# EAGLE design long (EAGLE 7.0.0)
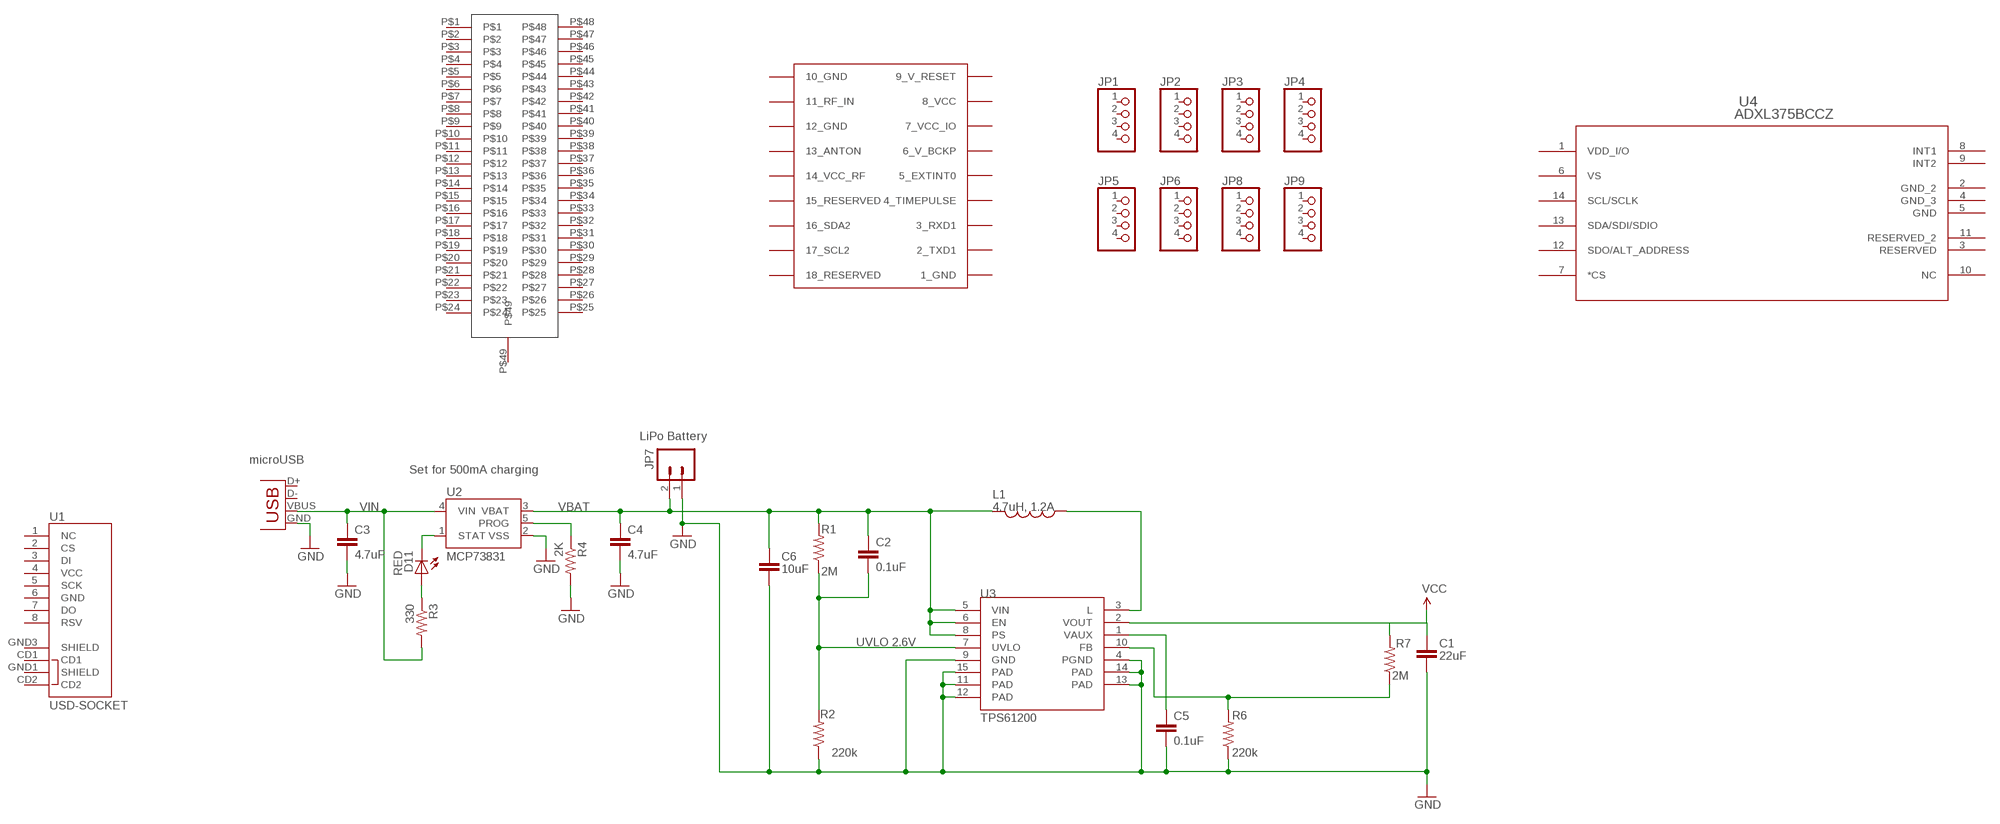
[diagram p0: schematic, sheet 1]

## Parts
C1  22uF  CAP0805  [0805]
C2  0.1uF  CAP0603-CAP  [0603-CAP]
C3  4.7uF  CAP0402-CAP  [0402-CAP]
C4  4.7uF  CAP0402-CAP  [0402-CAP]
C5  0.1uF  CAP0603-CAP  [0603-CAP]
C6  10uF  CAP1206  [1206]
D11  RED  LED0603  [LED-0603]
JP1  PINHD-1X4  [1X04]
JP2  PINHD-1X4  [1X04]
JP3  PINHD-1X4  [1X04]
JP4  PINHD-1X4  [1X04]
JP5  PINHD-1X4  [1X04]
JP6  PINHD-1X4  [1X04]
JP7  LiPo Battery  M02-JST-2MM-SMT  [JST-2-SMD]
JP8  PINHD-1X4  [1X04]
JP9  PINHD-1X4  [1X04]
L1  4.7uH, 1.2A  INDUCTOR.  [CDRH2D09]
R1  2M  RESISTOR0603-RES  [0603-RES]
R2  220k  RESISTOR0603-RES  [0603-RES]
R3  330  RESISTOR0402-RES  [0402-RES]
R4  2K  RESISTOR0402-RES  [0402-RES]
R6  220k  RESISTOR0603-RES  [0603-RES]
R7  2M  RESISTOR0603-RES  [0603-RES]
U1  USD-SOCKET  [MICROSD_1:1]
U2  MCP73831  [SOT23-5]
U3  TPS61200  [QFN-10_PAD]
U4  ADXL375BCCZ  [LGA_CC-14-1]
U$1  STM32F411CEU6  [STM32F411CEU6]
U$2  UBLOX_MAX  [UBLOX_MAX]
X1  Micro USB  USB-MICROB  [USB-MICROB]

## Nets
FB: R6.2 R7.1 U3.10(FB)
GND: C1.2 C3.2 C4.2 C5.2 C6.2 JP7.1 R2.1 R4.2 R6.1 U2.2(VSS) U3.4(PGND) U3.9(GND) U3.11(PAD) U3.12(PAD) U3.13(PAD) U3.14(PAD) U3.15(PAD) X1.GND
N$1: C5.1 U3.1(VAUX)
N$2: L1.P$1 U3.3(L)
N$3: D11.A R3.1
PROG: R4.1 U2.5(PROG)
STAT: D11.C U2.1(STAT)
UVLO: C2.2 R1.1 R2.2 U3.7(UVLO)
VBAT: C2.1 C4.1 C6.1 JP7.2 L1.P$2 R1.2 U2.3(VBAT) U3.5(VIN) U3.6(EN) U3.8(PS)
VCC: C1.1 R7.2 U3.2(VOUT)
VIN: C3.1 R3.2 U2.4(VIN) X1.VBUS
Unconnected: JP1.1 JP1.2 JP1.3 JP1.4 JP2.1 JP2.2 JP2.3 JP2.4 JP3.1 JP3.2 JP3.3 JP3.4 JP4.1 JP4.2 JP4.3 JP4.4 JP5.1 JP5.2 JP5.3 JP5.4 JP6.1 JP6.2 JP6.3 JP6.4 JP8.1 JP8.2 JP8.3 JP8.4 JP9.1 JP9.2 JP9.3 JP9.4 U1.1(NC) U1.2(CS) U1.3(DI) U1.4(VCC) U1.5(SCK) U1.6(GND) U1.7(DO) U1.8(RSV) U1.CD1 U1.CD2 U1.GND1(SHIELD) U1.GND3(SHIELD) U4.1(VDD_I/O) U4.2(GND_2) U4.3(RESERVED) U4.4(GND_3) U4.5(GND) U4.6(VS) U4.7(*CS) U4.8(INT1) U4.9(INT2) U4.10(NC) U4.11(RESERVED_2) U4.12(SDO/ALT_ADDRESS) U4.13(SDA/SDI/SDIO) U4.14(SCL/SCLK) U$1.P$1 U$1.P$2 U$1.P$3 U$1.P$4 U$1.P$5 U$1.P$6 U$1.P$7 U$1.P$8 U$1.P$9 U$1.P$10 U$1.P$11 U$1.P$12 U$1.P$13 U$1.P$14 U$1.P$15 U$1.P$16 U$1.P$17 U$1.P$18 U$1.P$19 U$1.P$20 U$1.P$21 U$1.P$22 U$1.P$23 U$1.P$24 U$1.P$25 U$1.P$26 U$1.P$27 U$1.P$28 U$1.P$29 U$1.P$30 U$1.P$31 U$1.P$32 U$1.P$33 U$1.P$34 U$1.P$35 U$1.P$36 U$1.P$37 U$1.P$38 U$1.P$39 U$1.P$40 U$1.P$41 U$1.P$42 U$1.P$43 U$1.P$44 U$1.P$45 U$1.P$46 U$1.P$47 U$1.P$48 U$1.P$49 U$2.2_TXD1 U$2.3_RXD1 U$2.4_TIMEPULSE U$2.5_EXTINT0 U$2.6_V_BCKP U$2.11_RF_IN U$2.13_ANTON U$2.14_VCC_RF U$2.15_RESERVED U$2.16_SDA2 U$2.17_SCL2 U$2.18_RESERVED X1.D+ X1.D-

## Notes on the sheet
- microUSB
- Set for 500mA charging
- UVLO 2.6V

## Power pins joined to a net without a drawn wire
1_GND: U$2.1_GND
7_VCC_IO: U$2.7_VCC_IO
8_VCC: U$2.8_VCC
9_V_RESET: U$2.9_V_RESET
10_GND: U$2.10_GND
12_GND: U$2.12_GND

## Library data of the parts
C1 C6 = CH_passive:CAP: Capacitor Standard 0603 ceramic capacitor, and 0.1" leaded capacitor.
C2-C5 = SparkFun:CAP: Capacitor Standard 0603 ceramic capacitor, and 0.1" leaded capacitor.
D11 = SparkFun:LED: LEDs Standard schematic elements and footprints for 5mm, 3mm, 1206, and 0603 sized LEDs. 5mm - Spark Fun Electronics SKU : COM-00529 (and others)
JP1-JP6 JP8 JP9 = pinhead:PINHD-1X4: PIN HEADER
JP7 = SparkFun:M02: Header 2 Standard 2-pin 0.1" header. Use with straight break away headers (SKU : PRT-00116), right angle break away headers (PRT-00553), swiss pins (PRT-00743), machine pins (PRT-00117), and female headers (PRT-00115). Molex polarized connector foot print use with SKU : PRT-08233 with associated crimp pins and housings.
L1 = SparkFun:INDUCTOR: Inductors Basic Inductor/Choke - 0603 and 1206. Footprints are not proven and vary greatly between part numbers.
R1-R4 R6 R7 = SparkFun:RESISTOR: Resistor Basic schematic elements and footprints for 0603, 1206, and PTH resistors.
U1 = SparkFun-Connectors:USD-SOCKET: microSD Socket Push-push type uSD socket. Schematic element and footprint production proven. Spark Fun Electronics SKU : PRT-00127. tDoc lines correctly indicate media card edge positions when inserting (unlocked, locked, depressed). NOTE: CD1 and CD2 are connected internally; PROD_ID: CONN-07820
U2 = SparkFun:MCP73831: Microchip's MCP73831 Miniature single cell, fully integrated Li-Ion, Li-polymer charge management controller http://ww1.microchip.com/downloads/en/DeviceDoc/21984a.pdf
U3 = SparkFun:TPS61200: DC to DC Booster
U4 = adxl375bccz:ADXL375BCCZ
U$1 = STM32F411CEU6:STM32F411CEU6
U$2 = Ava:UBLOX_MAX: UBLOX MAX
X1 = SparkFun:USB: USB Connectors USB-B-PTH is fully proven SKU : PRT-00139 USB-miniB is fully proven SKU : PRT-00587 USB-A-PCB is untested. USB-A-H is throughly reviewed, but untested. Spark Fun Electronics SKU : PRT-00437 USB-B-SMT is throughly reviewed, but untested. Needs silkscreen touching up. USB-A-S has not been used/tested USB-MB-H has not been used/tested

## Board
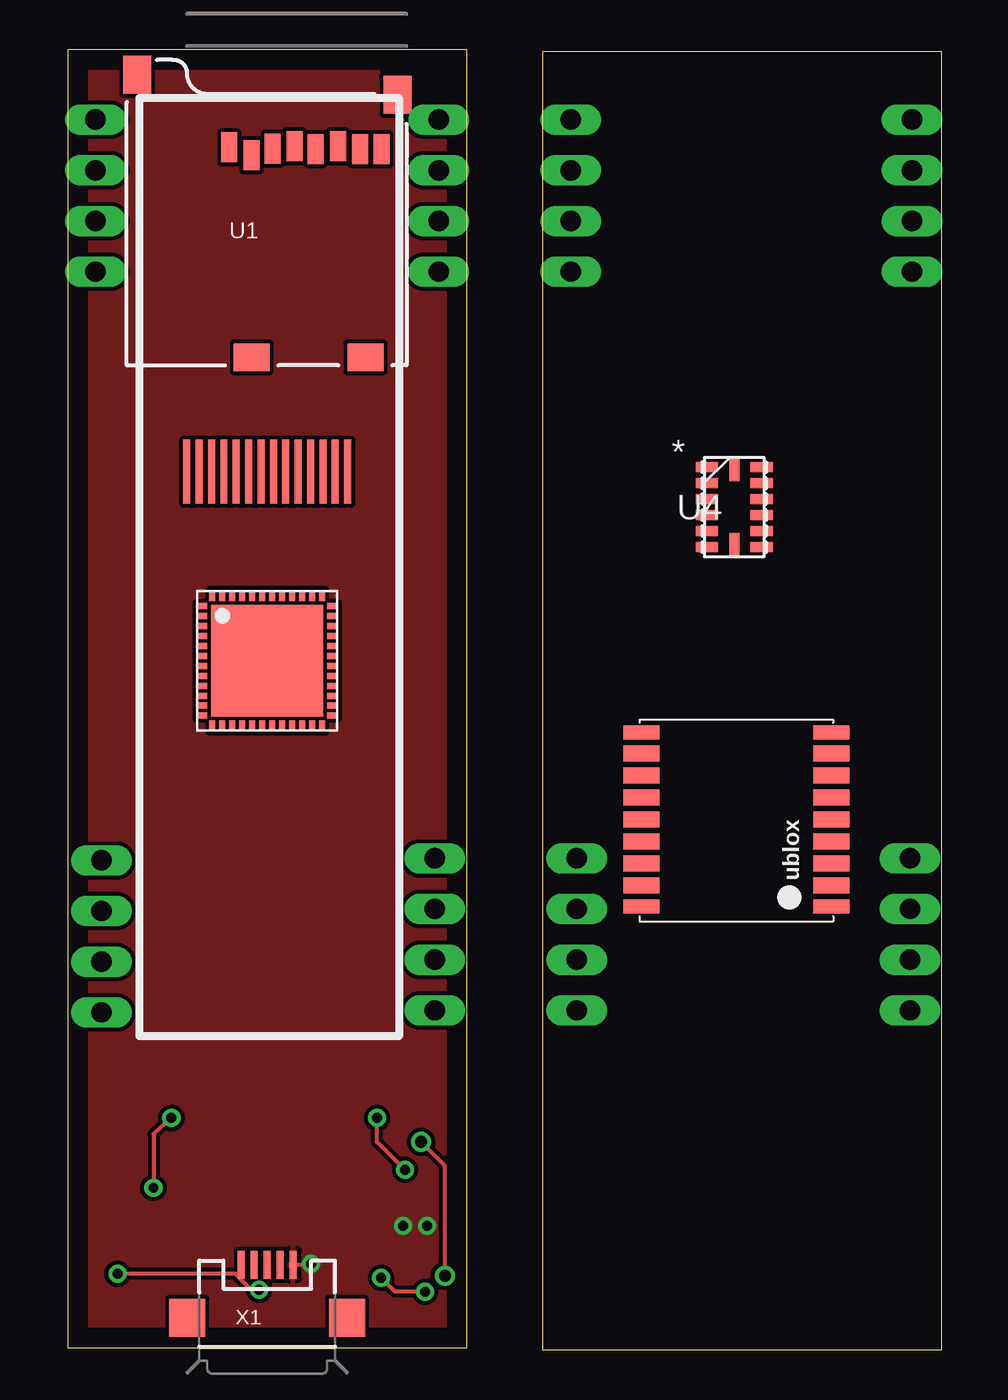
[diagram p1: board, top side]
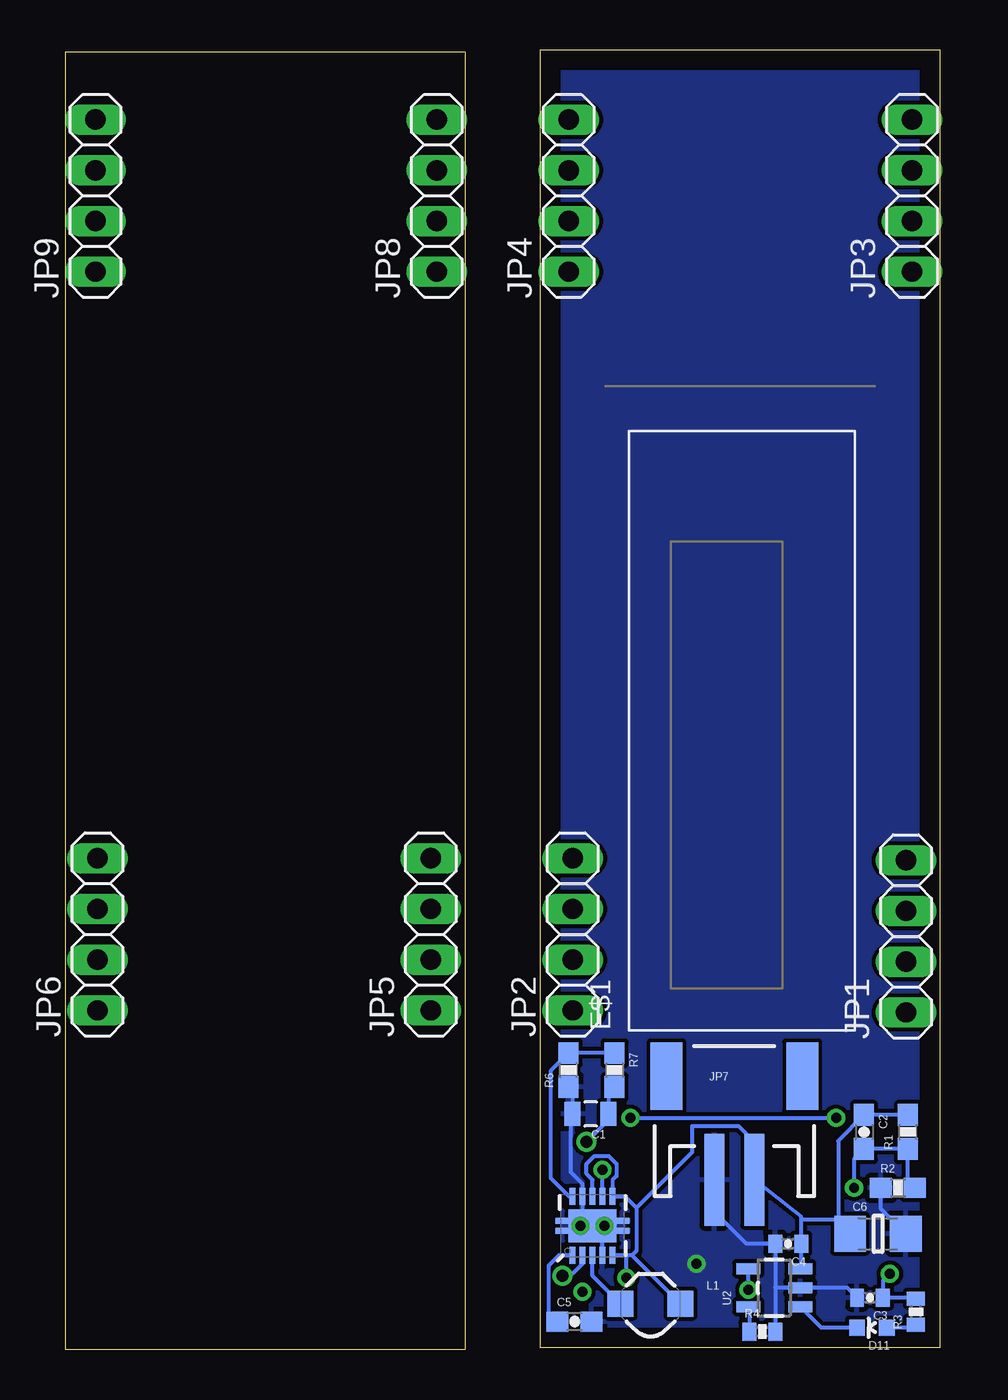
[diagram p2: board, bottom side, seen from below]

Size 43.8 x 65.1 mm. Coordinates in mm from the lower left corner, seen from the top.
Outline: 0,0.1 20,0.1 20,65.1 0,65.1 0,0.1
Outline: 23.8,0 43.8,0 43.8,65 23.8,65 23.8,0
Copper layers (1*16): Top 0.035mm / dielectric 1.5mm / Bottom 0.035mm
Design rules "default": minimum track width 10mil, minimum drill 24mil, track to track 8mil, track to pad 8mil, pad to pad 8mil, via to via 8mil, smd to smd 8mil, copper to edge 40mil, drill to drill 8mil, minimum pad ring 10mil, minimum via ring 8mil, stop-mask expansion 4mil, vias tented up to drill 0mil, thermal gap 10mil

### Footprints (pad centres in the part's own frame; a part is rotated, then mirrored left to right if it is on the bottom)
0805 = smd 0.8 x 1.2: 1 -0.9,0; 2 0.9,0
0603-CAP = smd 1.1 x 1: 1 -0.85,0; 2 0.85,0
0402-CAP = smd 0.7 x 0.9: 1 -0.65,0; 2 0.65,0
1206 = smd 1.6 x 1.8: 1 -1.4,0; 2 1.4,0
LED-0603 = smd 0.8 x 0.8: A 0,-0.75; C 0,0.75
UG-2832HSWEG02_WRAPUNDER = smd 3.2 x 0.35 bottom: 1 -2.03,-4.03; 2 -2.03,-3.41; 3 -2.03,-2.79; 4 -2.03,-2.17; 5 -2.03,-1.55; 6 -2.03,-0.93; 7 -2.03,-0.31; 8 -2.03,0.31; 9 -2.03,0.93; 10 -2.03,1.55; 11 -2.03,2.17; 12 -2.03,2.79; 13 -2.03,3.41; 14 -2.03,4.03
1X04 = drill 1.016 long: 1 -3.81,0; 2 -1.27,0; 3 1.27,0; 4 3.81,0
JST-2-SMD = smd 1 x 4.6: 1 -1,-3.7; 2 1,-3.7 | smd 1.6 x 3.4: NC1 -3.4,1.5; NC2 3.4,1.5
CDRH2D09 = smd 1.3 x 1.3: P$1 -1.5,0; P$2 1.5,0
0603-RES = smd 1.1 x 1: 1 -0.85,0; 2 0.85,0
0402-RES = smd 0.7 x 0.9: 1 -0.65,0; 2 0.65,0
MICROSD_1:1 = smd 0.8 x 1.5: 1 5.096,10.919; 2 6.218,10.519; 3 7.274,10.853; 4 8.367,10.982; 5 9.421,10.828; 6 10.539,10.973; 7 11.648,10.819; 8 12.721,10.819 | smd 1.8 x 1.4: CD1 11.92,0.4; CD2 6.22,0.4 | smd 1.4 x 1.9: GND1 0.497,14.55; GND3 13.52,13.55
SOT23-5 = smd 0.55 x 1.2: 1 -0.95,-1.3; 2 0,-1.3; 3 0.95,-1.3; 4 0.95,1.3; 5 -0.95,1.3
QFN-10_PAD = smd 0.297 x 0.85: 1 -1,-1.475; 2 -0.5,-1.475; 3 0,-1.475; 4 0.5,-1.475; 5 1,-1.475; 6 1,1.475; 7 0.5,1.475; 8 0,1.475; 9 -0.5,1.475; 10 -1,1.475 | smd 0.7 x 0.28: 11 -1.5,0.25; 12 -1.5,-0.25; 13 1.5,0.25; 14 1.5,-0.25 | smd 2.4 x 1.65: 15 0,0
LGA_CC-14-1 = smd 1.118 x 0.508: 1 -1.371,2; 2 -1.371,1.2; 3 -1.371,0.4; 4 -1.371,-0.4; 5 -1.371,-1.2; 6 -1.371,-2; 8 1.371,-2; 9 1.371,-1.2; 10 1.371,-0.4; 11 1.371,0.4; 12 1.371,1.2; 13 1.371,2 | smd 0.508 x 1.118: 7 0,-1.871; 14 0,1.871
STM32F411CEU6 = smd 0.55 x 0.3: P$1 0.225,6.25; P$2 0.225,5.75; P$3 0.225,5.25; P$4 0.225,4.75; P$5 0.225,4.25; P$6 0.225,3.75; P$7 0.225,3.25; P$8 0.225,2.75; P$9 0.225,2.25; P$10 0.225,1.75; P$11 0.225,1.25; P$12 0.225,0.75; P$25 6.775,0.75; P$26 6.775,1.25; P$27 6.775,1.75; P$28 6.775,2.25; P$29 6.775,2.75; P$30 6.775,3.25; P$31 6.775,3.75; P$32 6.775,4.25; P$33 6.775,4.75; P$34 6.775,5.25; P$35 6.775,5.75; P$36 6.775,6.25 | smd 0.3 x 0.55: P$13 0.75,0.225; P$14 1.25,0.225; P$15 1.75,0.225; P$16 2.25,0.225; P$17 2.75,0.225; P$18 3.25,0.225; P$19 3.75,0.225; P$20 4.25,0.225; P$21 4.75,0.225; P$22 5.25,0.225; P$23 5.75,0.225; P$24 6.25,0.225; P$37 6.25,6.775; P$38 5.75,6.775; P$39 5.25,6.775; P$40 4.75,6.775; P$41 4.25,6.775; P$42 3.75,6.775; P$43 3.25,6.775; P$44 2.75,6.775; P$45 2.25,6.775; P$46 1.75,6.775; P$47 1.25,6.775; P$48 0.75,6.775 | smd 5.6 x 5.6: P$49 3.5,3.5
UBLOX_MAX = smd 1.8 x 0.7: 1_GND 4.95,-4.4; 9_V_RESET 4.95,4.3; 10_GND -4.55,4.3; 18_RESERVED -4.55,-4.4 | smd 1.8 x 0.8: 2_TXD1 4.95,-3.35; 3_RXD1 4.95,-2.25; 4_TIMEPULSE 4.95,-1.15; 5_EXTINT0 4.95,-0.05; 6_V_BCKP 4.95,1.05; 7_VCC_IO 4.95,2.15; 8_VCC 4.95,3.25; 11_RF_IN -4.55,3.25; 12_GND -4.55,2.15; 13_ANTON -4.55,1.05; 14_VCC_RF -4.55,-0.05; 15_RESERVED -4.55,-1.15; 16_SDA2 -4.55,-2.25; 17_SCL2 -4.55,-3.35
USB-MICROB = smd 0.35 x 1.4: D+ 0,2.65; D- -0.65,2.65; GND 1.3,2.65; ID 0.65,2.65; VBUS -1.3,2.65 | smd 1.8 x 1.9: MT1 -4,0; MT2 4,0

### Placement (x,y rotation side)
C1  17.5,11.8 180 bottom
C2  3.8,10.9 270 bottom
C3  3.5,2.6 180 bottom
C4  7.6,5.3 180 bottom
C5  18.3,1.4 0 bottom
C6  3.1,5.8 0 bottom
D11  3.4,1.1 90 bottom
E$1  [UG-2832HSWEG02_WRAPUNDER]  10,46 90 bottom
JP1  1.7,20.7 90 bottom
JP2  18.4,20.8 90 bottom
JP3  1.4,57.8 90 bottom
JP4  18.6,57.8 90 bottom
JP5  25.5,20.8 90 bottom
JP6  42.2,20.8 90 bottom
JP7  10.3,12.2 0 bottom
JP8  25.2,57.8 90 bottom
JP9  42.3,57.8 90 bottom
L1  14.5,2.3 0 bottom
R1  1.6,10.9 90 bottom
R2  2.1,8.1 0 bottom
R3  1.2,1.9 90 bottom
R4  8.9,0.9 0 bottom
R6  18.6,14 90 bottom
R7  16.3,14 270 bottom
U1  3,49.3 0 top
U2  8.3,3.1 90 bottom
U3  17.4,6.2 0 bottom
U4  33.4,42.2 0 top
U$1  6.5,31 0 top
U$2  33.3,26.6 0 top
X1  10,1.6 0 top

### Tracks (layer width: path | path; a pad name or v marks a point on that pad's centre or on a via)
FB
  Bottom 0.2: R7.1 R6.2 19.5,13.95 19.5,8.6 18.57,7.67 U3.10
GND  (via drill 0.5 pad 0.41)
  Top 0.2: X1.GND v12.2,4.3
  Bottom 0.2: C3.2 4.65,3.1 U2.2 8.25,3.1 | 8.25,3.1 R4.2 | 8.25,3.1 C4.2 9.7,5.3 11.3,6.9 JP7.1 | C6.2 2.95,7.05 R2.1 | R6.1 18.4,13.05 C1.2 18.5,11.2 18.5,8.9 17.9,8.3 U3.9 17.9,6.6 17.5,6.2 U3.15 | U3.4 16.9,5.7 U3.15 | U3.13 U3.15 | U3.14 U3.15 | U3.11 v16.8,6.2 U3.12
  other vias: 18,6.2
  pour Bottom: 20.1,65.2 20.1,0 -0.1,0 -0.1,65.2
  pour Top: 20.3,65.4 20.3,-0.2 -0.3,-0.2 -0.3,65.4
N$1
  Bottom 0.2: U3.1 19.07,4.72 19.6,4.2 19.6,1.85 C5.1
N$2
  Bottom 0.2: L1.P$1 17.4,3.7 U3.3
N$3
  Bottom 0.2: R3.1 1.35,1.1 D11.A
  Bottom 0.406: 2.65,1.25 D11.A
PROG
  Bottom 0.2: U2.5 9.55,2.15 R4.1
  Bottom 0.406: R4.1 9.6,0.9
STAT
  Bottom 0.2: D11.C 5.95,1.1 U2.1
UVLO  (via drill 0.5 pad 0.41)
  Top 0.2: v16.9,9 15.5,10.4 v15.5,11.6 | v5.2,11.6 4.3,10.8 v4.3,8.1
  Bottom 0.2: R2.2 1.6,8.45 R1.1 C2.2 4.3,9.55 v4.3,8.1 | U3.7 v16.9,9 | v15.5,11.6 v5.2,11.6
VBAT  (via drill 0.5 pad 0.41)
  Top 0.2: v17.9,2.9 16.4,2.9 v15.7,3.6
  Bottom 0.2: U2.3 6.95,4.05 C4.1 6.95,6.5 | 6.95,6.5 6.95,6.65 JP7.2 | R1.2 C2.1 5.1,10.45 5.1,6.3 4.6,5.8 C6.1 5.2,6.5 6.95,6.5 | L1.P$2 15.43,4.72 | 15.43,4.72 15.8,4.72 | 15.8,4.72 U3.5 | 15.2,7.1 15.78,7.67 U3.6 16.4,8.5 16.2,8.7 16.2,9.3 16.6,9.7 17.3,9.7 17.7,9.3 17.7,8.8 17.4,8.5 U3.8 | 15.2,7.1 15.2,4.95 15.43,4.72 | v15.7,3.6 15.7,4.62 15.8,4.72 | JP7.2 9.3,8.9 | 15.2,7.1 12.4,9.9 12.4,11.2 10.1,11.2 9.3,10.4 JP7.2
  Bottom 0.406: C4.1 7,5.3
VCC  (via drill 0.6)
  Top 0.2: v18.9,3.7 18.9,9.2 v17.7,10.4
  Bottom 0.2: U3.2 17.9,4.3 18.4,3.8 18.8,3.8 v18.9,3.7 | C1.1 16.6,11.6 16.4,11.4 | v17.7,10.4 16.6,11.5 C1.1 | R7.2 16.6,12.95 C1.1
VIN  (via drill 0.5 pad 0.41)
  Top 0.2: 8.7,3.5 9.2,3 v9.6,3 | X1.VBUS 8.7,3.5 | 8.7,3.5 8.4,3.8 v2.5,3.8
  Bottom 0.2: R3.2 1.25,2.6 C3.1 2.85,3.45 v2.5,3.8 | v9.6,3 | v9.6,3 U2.4
  Bottom 0.406: 2.85,2.55 C3.1